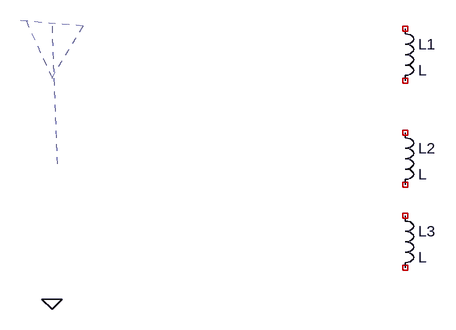
[diagram p0: schematic Experimental.asc]
Experimental.asc, the LTspice schematic file:
Version 4
SHEET 1 880 688
FLAG -208 672 0
SYMBOL ind 320 240 R0
SYMATTR InstName L1
SYMBOL ind 320 400 R0
SYMATTR InstName L2
SYMBOL ind 320 528 R0
SYMATTR InstName L3
LINE Normal -248 244 -208 332 2
LINE Normal -208 332 -160 252 2
LINE Normal -160 252 -256 244 2
LINE Normal -208 252 -200 464 2

The netlist it stands for:
* Experimental.asc
L1 NC_01 NC_02 L
L2 NC_03 NC_04 L
L3 NC_05 NC_06 L
.backanno
.end